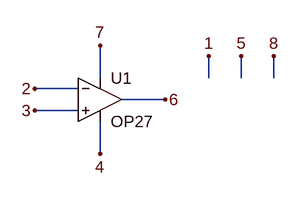
[diagram p0: schematic Dip-op27.asc]
Dip-op27.asc, the LTspice schematic file:
Version 4
SHEET 1 880 680
WIRE 288 128 288 80
WIRE 448 128 448 96
WIRE 496 128 496 96
WIRE 544 128 544 96
WIRE 256 144 192 144
WIRE 384 160 320 160
WIRE 256 176 192 176
WIRE 288 240 288 192
FLAG 288 80 7
FLAG 288 240 4
FLAG 384 160 6
FLAG 192 144 2
FLAG 192 176 3
FLAG 448 96 1
FLAG 496 96 5
FLAG 544 96 8
SYMBOL OpAmps\\OP27 288 96 R0
SYMATTR InstName U1

The netlist it stands for:
* Dip-op27.asc
XU1 3 2 7 4 6 OP27  ; pins In+ In- V+ V- OUT
.lib ADI.lib
.backanno
.end